# EAGLE design Arduino_MEGA2560 (EAGLE 7.4.0)
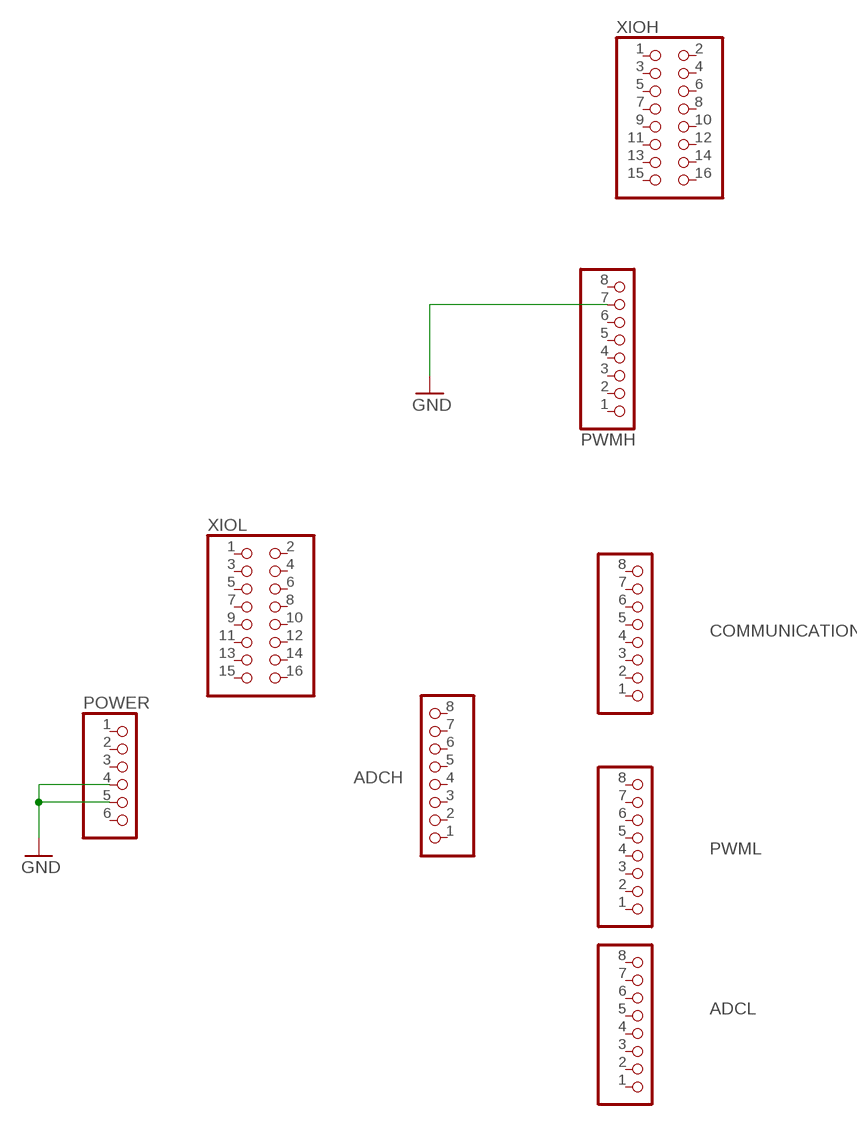
[diagram p0: schematic, sheet 1]

## Parts
ADCH  PINHD-1X8  [1X08]
ADCL  PINHD-1X8  [1X08]
COMMUNICATION  PINHD-1X8  [1X08]
POWER  PINHD-1X6  [1X06]
PWMH  PINHD-1X8  [1X08]
PWML  PINHD-1X8  [1X08]
XIOH  PINHD-2X8  [2X08]
XIOL  PINHD-2X8  [2X08]

## Nets
GND: POWER.4 POWER.5 PWMH.7
Unconnected: ADCH.1 ADCH.2 ADCH.3 ADCH.4 ADCH.5 ADCH.6 ADCH.7 ADCH.8 ADCL.1 ADCL.2 ADCL.3 ADCL.4 ADCL.5 ADCL.6 ADCL.7 ADCL.8 COMMUNICATION.1 COMMUNICATION.2 COMMUNICATION.3 COMMUNICATION.4 COMMUNICATION.5 COMMUNICATION.6 COMMUNICATION.7 COMMUNICATION.8 POWER.1 POWER.2 POWER.3 POWER.6 PWMH.1 PWMH.2 PWMH.3 PWMH.4 PWMH.5 PWMH.6 PWMH.8 PWML.1 PWML.2 PWML.3 PWML.4 PWML.5 PWML.6 PWML.7 PWML.8 XIOH.1 XIOH.2 XIOH.3 XIOH.4 XIOH.5 XIOH.6 XIOH.7 XIOH.8 XIOH.9 XIOH.10 XIOH.11 XIOH.12 XIOH.13 XIOH.14 XIOH.15 XIOH.16 XIOL.1 XIOL.2 XIOL.3 XIOL.4 XIOL.5 XIOL.6 XIOL.7 XIOL.8 XIOL.9 XIOL.10 XIOL.11 XIOL.12 XIOL.13 XIOL.14 XIOL.15 XIOL.16

## Library data of the parts
ADCH ADCL COMMUNICATION PWMH PWML = pinhead:PINHD-1X8: PIN HEADER
POWER = pinhead:PINHD-1X6: PIN HEADER
XIOH XIOL = pinhead:PINHD-2X8: PIN HEADER

## Net classes
0 default: width 0.15 mm, drill 0.3 mm, clearance 0.15 mm

## Board
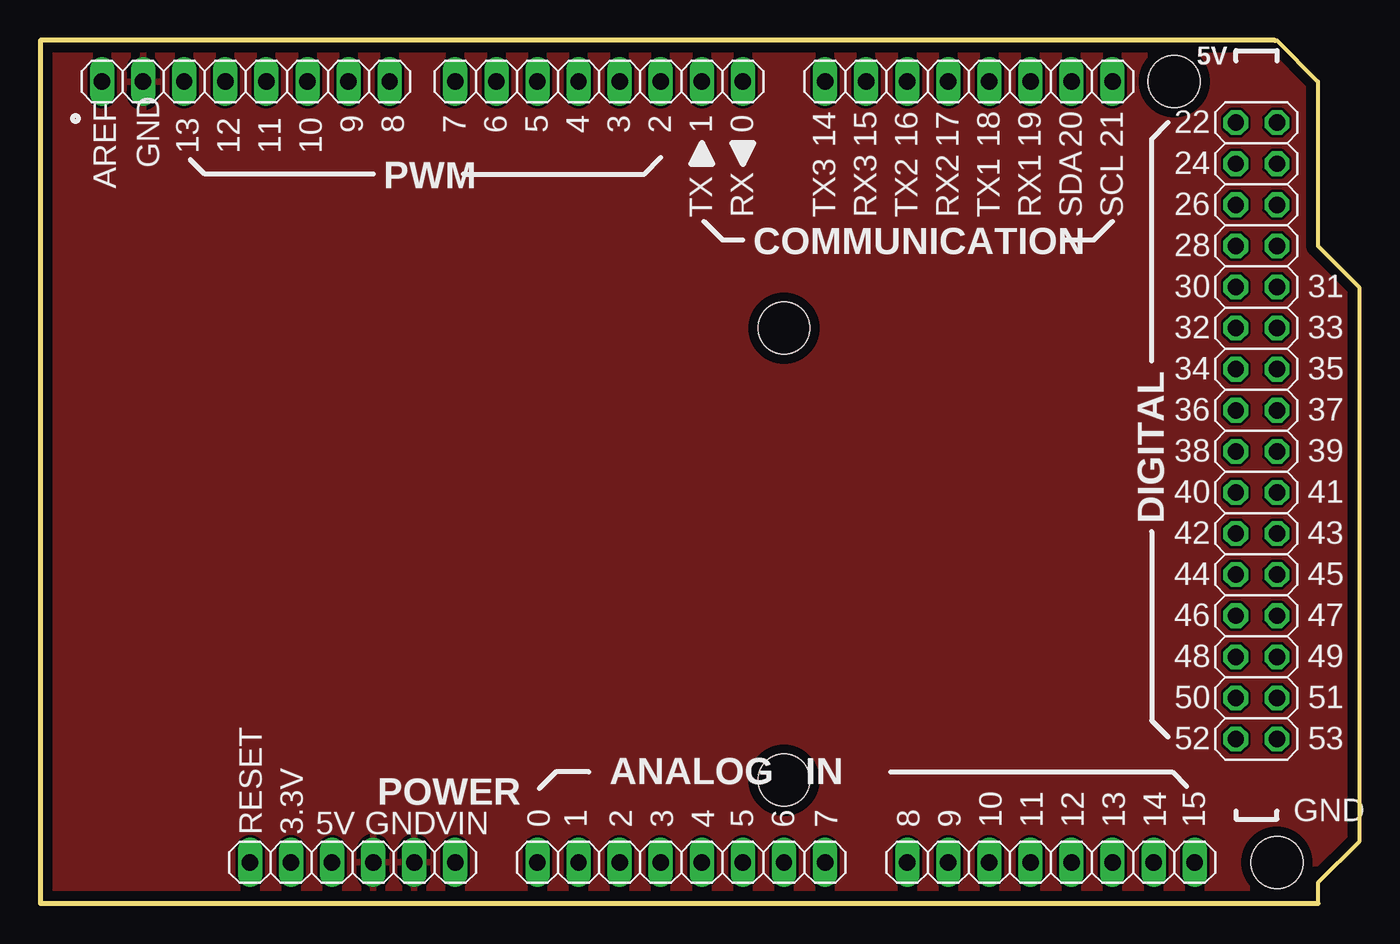
[diagram p1: board, top side]
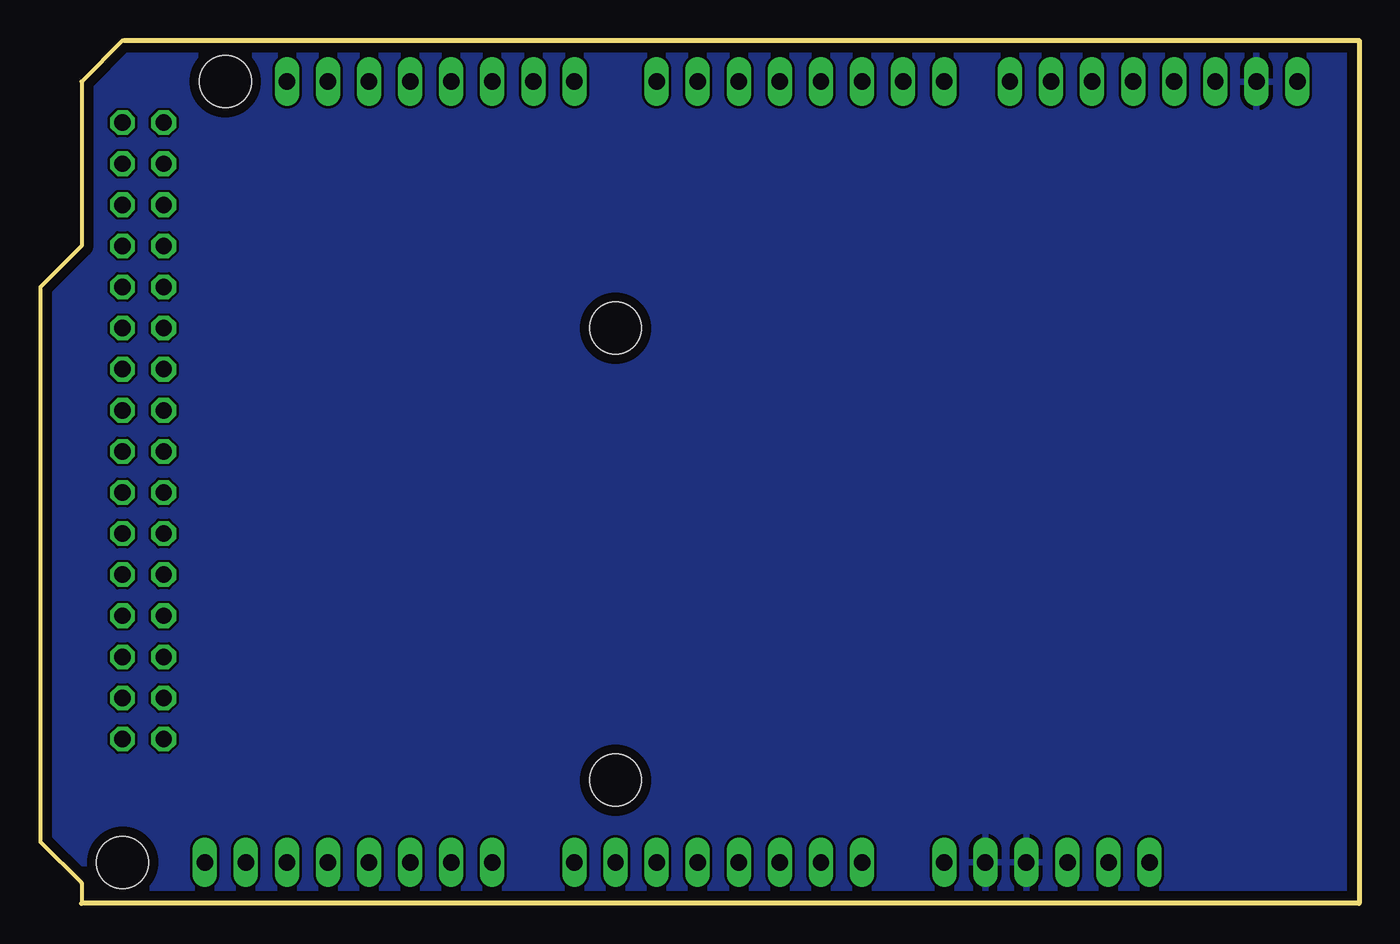
[diagram p2: board, bottom side, seen from below]

Size 81.53 x 53.34 mm. Coordinates in mm from the lower left corner, seen from the top.
Outline: 76.45,53.34 78.99,50.8 78.99,40.64 81.53,38.1 81.53,3.81 78.99,1.27 78.99,0 0,0 0,53.34 76.33,53.34
Copper layers (1*16): Top 0.035mm / dielectric 1.5mm / Bottom 0.035mm
Design rules "default *": minimum track width 0.15mm, minimum drill 0.3mm, track to track 0.15mm, track to pad 0.15mm, pad to pad 0.15mm, via to via 0.15mm, smd to smd 0.15mm, copper to edge 0.6mm, drill to drill 0.3mm, minimum pad ring 10mil, minimum via ring 10mil, stop-mask expansion 2mil, vias tented up to drill 1mil, thermal gap 10mil
Holes 3.2 mm at 76.45,2.54 70.1,50.8 45.97,35.56 45.97,7.62

### Footprints (pad centres in the part's own frame; a part is rotated, then mirrored left to right if it is on the bottom)
1X08 = drill 1.016 long: 1 -8.89,0; 2 -6.35,0; 3 -3.81,0; 4 -1.27,0; 5 1.27,0; 6 3.81,0; 7 6.35,0; 8 8.89,0
1X06 = drill 1.016 long: 1 -6.35,0; 2 -3.81,0; 3 -1.27,0; 4 1.27,0; 5 3.81,0; 6 6.35,0
2X08 = drill 1.016 octagon: 1 -8.89,-1.27; 2 -8.89,1.27; 3 -6.35,-1.27; 4 -6.35,1.27; 5 -3.81,-1.27; 6 -3.81,1.27; 7 -1.27,-1.27; 8 -1.27,1.27; 9 1.27,-1.27; 10 1.27,1.27; 11 3.81,-1.27; 12 3.81,1.27; 13 6.35,-1.27; 14 6.35,1.27; 15 8.89,-1.27; 16 8.89,1.27

### Placement (x,y rotation side)
ADCH  62.48,2.54 0 top
ADCL  39.62,2.54 0 top
COMMUNICATION  57.4,50.8 180 top
POWER  19.3,2.54 0 top
PWMH  12.7,50.8 180 top
PWML  34.54,50.8 180 top
XIOH  75.18,39.37 90 top
XIOL  75.18,19.05 90 top

### Tracks (layer width: path | path; a pad name or v marks a point on that pad's centre or on a via)
GND
  pour Bottom: 0.13,53.34 0.13,0.25 0.51,-0.13 78.74,-0.13 79.12,0.25 79.12,1.4 79.25,1.52 79.25,1.78 81.66,4.19 81.66,37.85 78.99,40.51 78.99,50.67 76.2,53.47 0.13,53.47 0,53.59
  pour Top: 0,53.34 0,0.13 78.74,0.13 78.74,0.25 78.99,0.25 78.99,1.14 78.99,1.4 81.66,4.06 81.66,37.59 81.28,37.97 81.28,38.35 79.12,40.51 79.12,50.67 78.74,51.05 76.58,53.21 0.38,53.21 0.25,53.34 0.13,53.34 0,53.47

### Text on the board
tPlace: 9 | 8 | 7 | 6 | 5 | 4 | 3 | 2 | 1 | 0 | 22 | 14 | 15 | 16 | 17 | 18 | 19 | 20 | 21 | 13 | 12 | 11 | 10 | 24 | 26 | 28 | 30 | 31 | 32 | 33 | 34 | 35 | 36 | 37 | 38 | 39 | 40 | 41 | 42 | 43 | 44 | 45 | 46 | 47 | 48 | 49 | 50 | 51 | 52 | 53 | 0 | 1 | 2 | 3 | 4 | 5 | 6 | 7 | 8 | 9 | 10 | 11 | 12 | 13 | 14 | 15
tNames: 5V | GND | AREF | PWM | TX | RX | TX3 | RX3 | TX2 | RX2 | TX1 | RX1 | SDA | SCL | DIGITAL | ANALOG IN | GND | RESET | 3.3V | 5V | GND | VIN